# EAGLE schematic nixie_arduino (EAGLE 6.1)
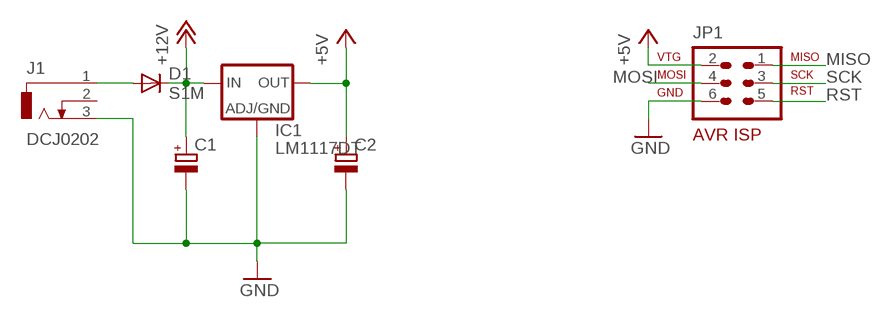
[diagram p0: schematic, sheet 1]

## Parts
C1  CPOL-EUD  [PANASONIC_D]
C2  CPOL-EUD  [PANASONIC_D]
D1  S1M  [DO-214AC]
IC1  LM1117DT  [DPACK]
J1  DCJ0202  [DCJ0202A]
JP1  AVR-ISP-6  [AVR-ISP-6]

## Nets
+5V: C2.+ IC1.4(OUT) JP1.2(VTG)
+12V: C1.+ D1.C IC1.3(IN)
GND: C1.- C2.- IC1.1(ADJ) J1.3 JP1.6(GND)
MISO: JP1.1(MISO)
MOSI: JP1.4(MOSI)
N$1: D1.A J1.1
RST: JP1.5(RST)
SCK: JP1.3(SCK)
Unconnected: J1.2

## Library data of the parts
C1 C2 = nixie_tube:CPOL-EU: POLARIZED CAPACITOR, European symbol
D1 = nixie_tube:S1M
IC1 = nixie_tube:LM1117: Low drop fixed and adjustable positive voltage regulators 1 A Source: http://www.st.com/stonline/products/literature/ds/7194/ld1117axx.pdf
J1 = nixie_tube:DCJ0202: DC POWER JACK Source: DCJ0202.pdf
JP1 = nixie_tube:AVR-ISP-6: AVR ISP-6 Serial Programming Header